# EAGLE design untitled (EAGLE 9.6.2)
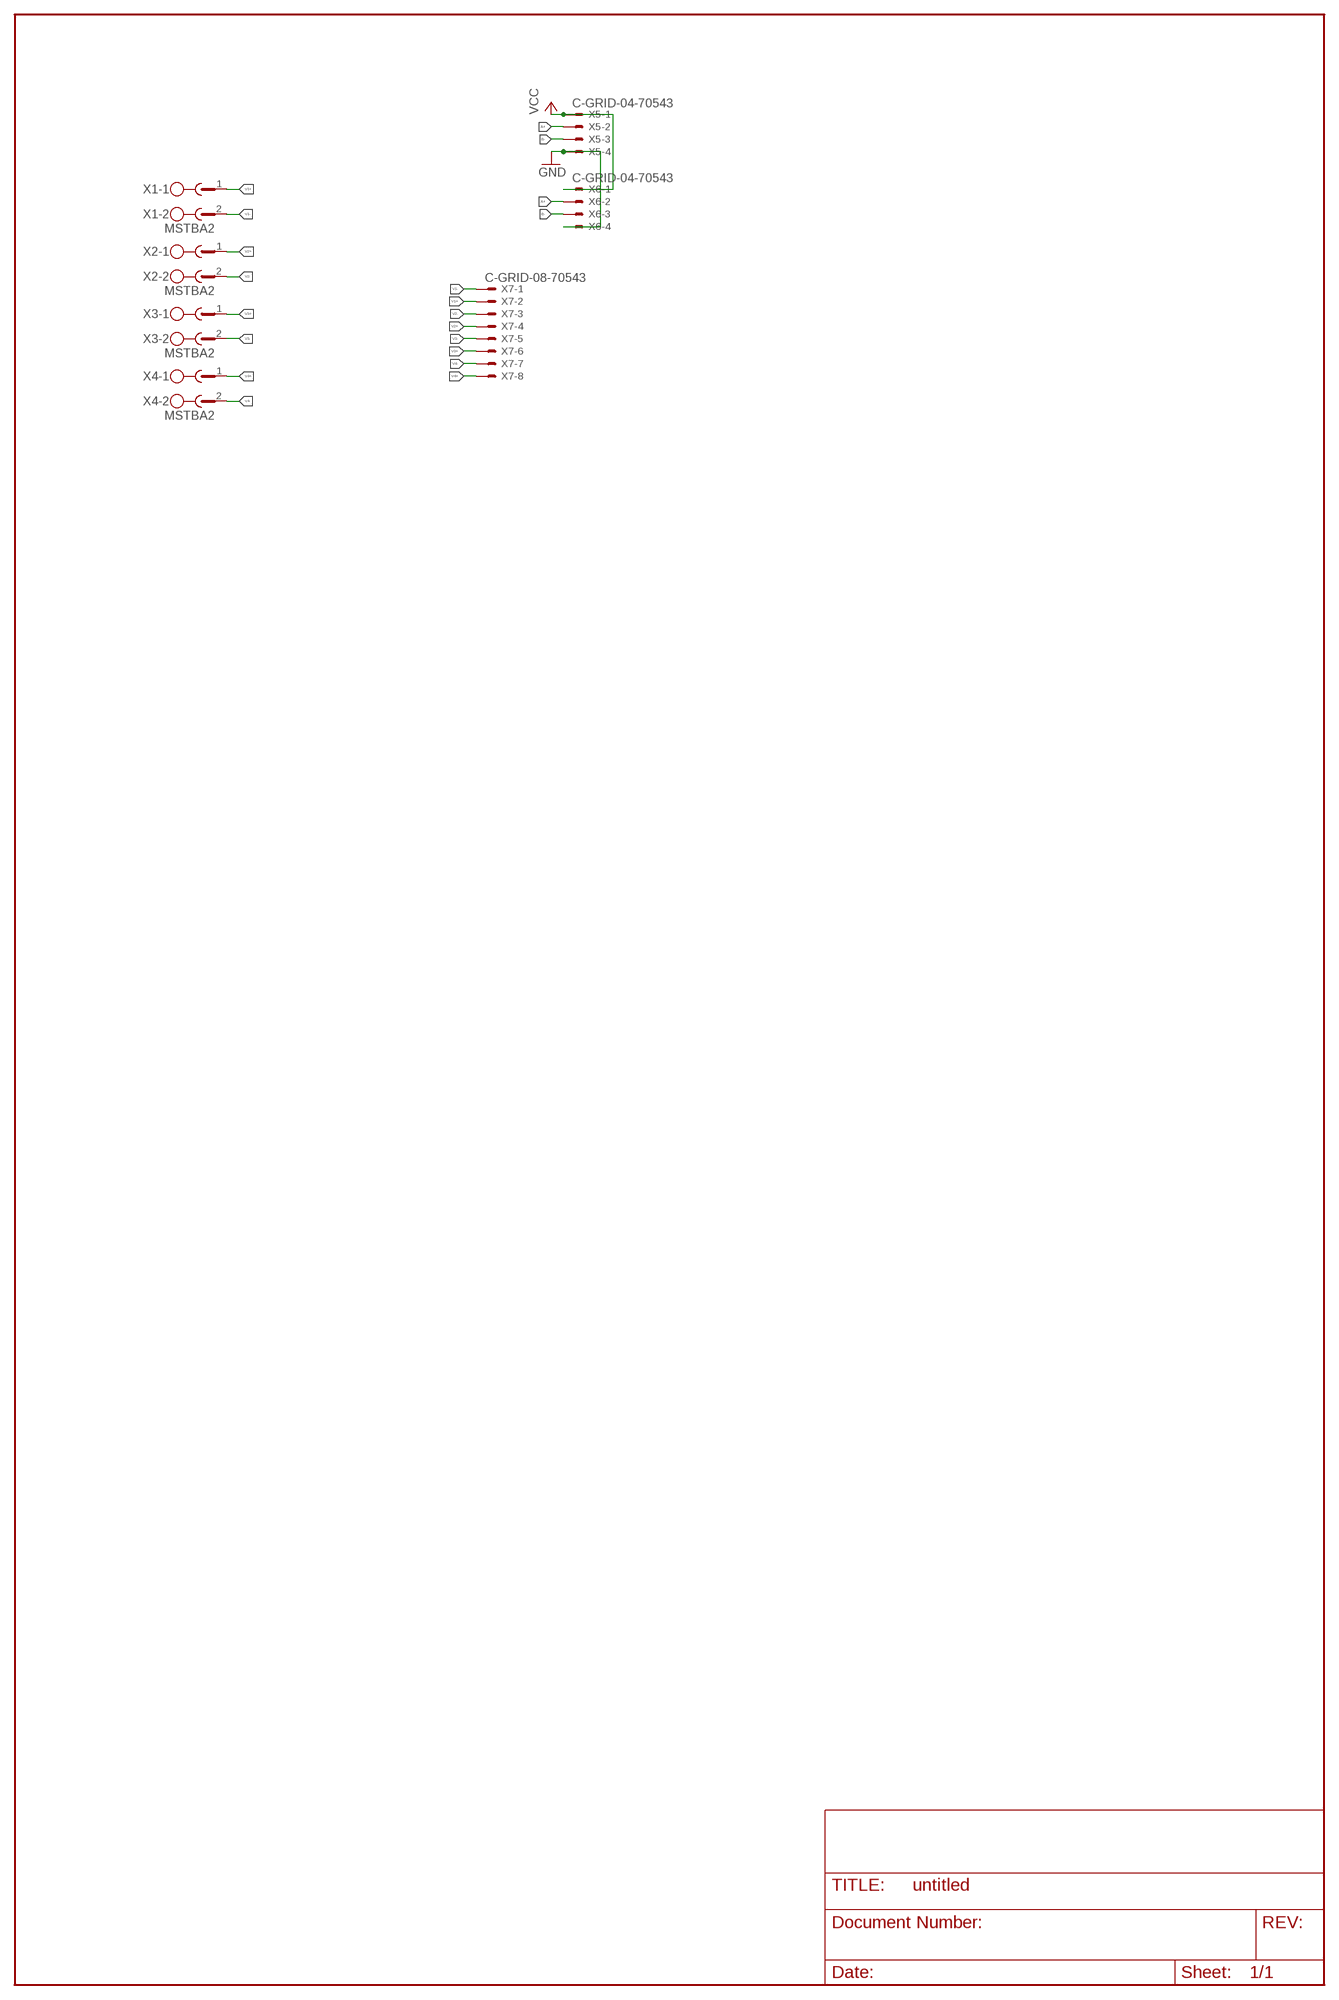
[diagram p0: schematic, sheet 1]

## Parts
X1  MSTBA2  [MSTBA2]
X2  MSTBA2  [MSTBA2]
X3  MSTBA2  [MSTBA2]
X4  MSTBA2  [MSTBA2]
X5  C-GRID-04-70543  [70543-04]
X6  C-GRID-04-70543  [70543-04]
X7  C-GRID-08-70543  [70543-08]

## Nets
A+: X5.2 X6.2
B-: X5.3 X6.3
GND: X5.4 X6.4
V1+: X1.1 X7.2
V1-: X1.2 X7.1
V2+: X2.1 X7.4
V2-: X2.2 X7.3
V3+: X3.1 X7.6
V3-: X3.2 X7.5
V4+: X4.1 X7.8
V4-: X4.2 X7.7
VCC: X5.1 X6.1

## Library data of the parts
X1-X4 = con-phoenix-508:MSTBA2: PHOENIX; MF: FARNELL; MPN: 1757242; OC_FARNELL: 3705171; OC_NEWARK: 71C4161
X5 X6 = con-molex:C-GRID-04: CONNECTOR wire to board 2.54 mm (0.100") pitch header; MF: MOLEX; OC_FARNELL: unknown; OC_NEWARK: unknown
X7 = con-molex:C-GRID-08: CONNECTOR wire to board 2.54 mm (0.100") pitch header; MF: MOLEX; OC_FARNELL: unknown; OC_NEWARK: unknown

## Board
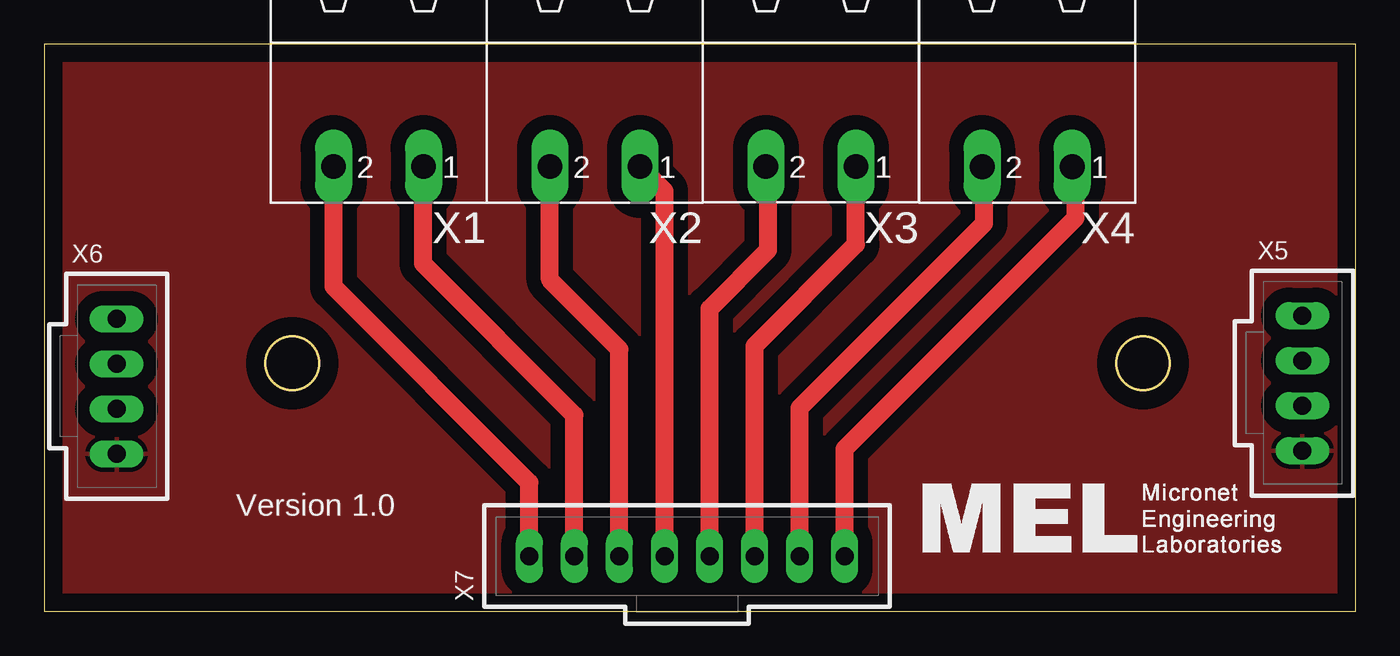
[diagram p1: board, top side]
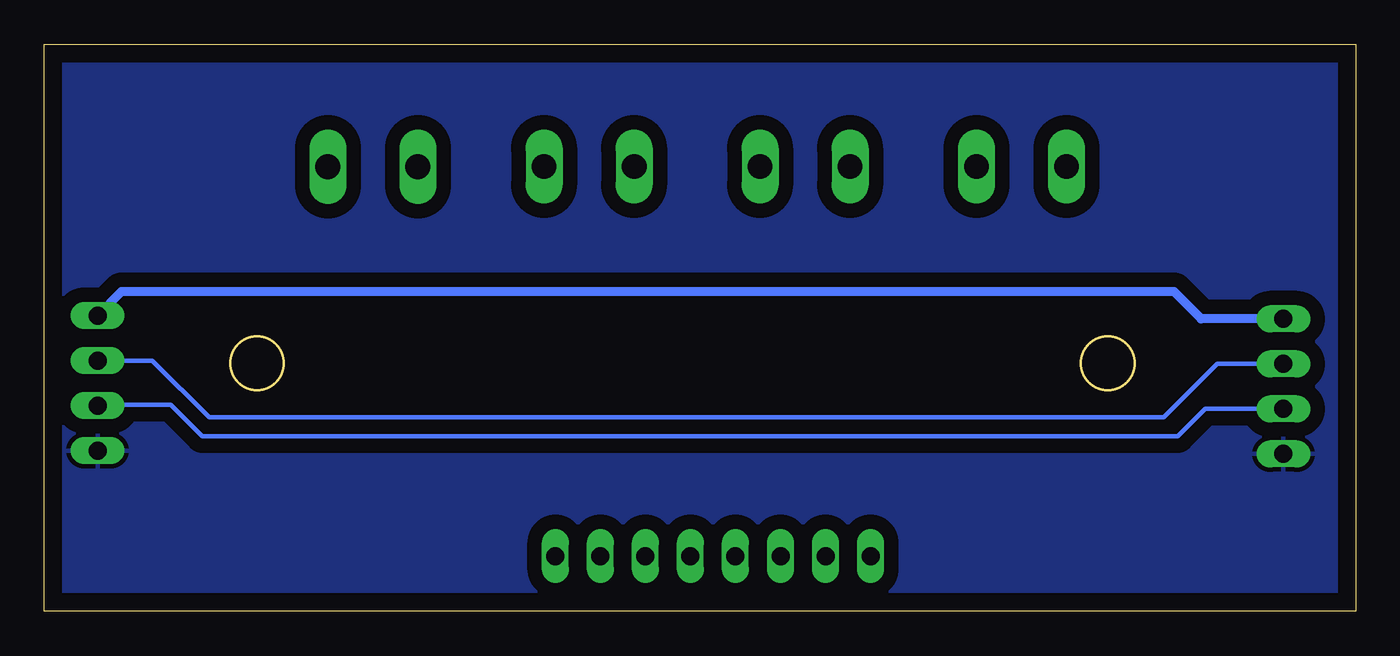
[diagram p2: board, bottom side, seen from below]

Size 74 x 32 mm. Coordinates in mm from the lower left corner, seen from the top.
Outline: 0,0 74,0 74,32 0,32 0,0
Outline: circle at 14,14 radius 1.5
Outline: circle at 62,14 radius 1.5
Copper layers (1*16): Top 0.035mm / dielectric 1.5mm / Bottom 0.035mm
Design rules "default": minimum track width 6mil, minimum drill 0.35mm, track to track 6mil, track to pad 6mil, pad to pad 6mil, via to via 6mil, smd to smd 6mil, copper to edge 40mil, drill to drill 6mil, minimum pad ring 10mil, minimum via ring 8mil, stop-mask expansion 4mil, vias tented up to drill 0mil, thermal gap 10mil

### Footprints (pad centres in the part's own frame; a part is rotated, then mirrored left to right if it is on the bottom)
MSTBA2 = drill 1.397 long: 1 -2.54,5.08; 2 2.54,5.08
70543-04 = drill 1.016 long: 1 -3.81,0; 2 -1.27,0; 3 1.27,0; 4 3.81,0
70543-08 = drill 1.016 long: 1 -8.89,0; 2 -6.35,0; 3 -3.81,0; 4 -1.27,0; 5 1.27,0; 6 3.81,0; 7 6.35,0; 8 8.89,0

### Placement (x,y rotation side)
X1  18.86,30.18 180 top
X2  31.07,30.18 180 top
X3  43.26,30.19 180 top
X4  55.46,30.17 180 top
X5  71,12.88 270 top
X6  4.09,12.7 270 top
X7  36.27,3.12 0 top

### Tracks (layer width: path | path; a pad name or v marks a point on that pad's centre or on a via)
A+
  Bottom 0.254: X6.2 7.8,13.97 10.82,10.95 64.7,10.95 67.9,14.15 X5.2
B-
  Bottom 0.254: X6.3 8.5,11.43 10.04,9.89 65.08,9.89 66.85,11.67 70.94,11.67 X5.3
GND
  pour Bottom (isolate 0.813): 0,32 74,32 74,0 0,0
  pour Top (isolate 0.813): 0,32 74,32 74,0 0,0
V1+
  Top 1.016: X7.2 29.92,11.08 21.38,19.62 21.38,25.08 X1.1
V1-
  Top 1.016: X7.1 27.38,7.27 16.32,18.33 X1.2
V2+
  Top 1.016: X7.4 35,23.71 X2.1
V2-
  Top 1.016: X7.3 32.46,14.79 28.53,18.72 X2.2
V3+
  Top 1.016: X7.6 40.08,14.98 45.8,20.7 X3.1
V3-
  Top 1.016: X7.5 37.54,17.09 40.84,20.4 40.84,24.98 X3.2
V4+
  Top 1.016: X7.8 45.16,9.17 58.19,22.21 58.19,24.9 X4.1
V4-
  Top 1.016: X7.7 42.62,11.48 53.03,21.9 53.03,24.98 X4.2
VCC
  Bottom 0.508: X6.1 8.72,16.51 10.25,18.04 69.65,18.04 X5.1

### Text on the board
tNames: Version 1.0